# EAGLE design CAPT-B1-02 Cap Touch Matrix FeatherWing (EAGLE 9.4.2)
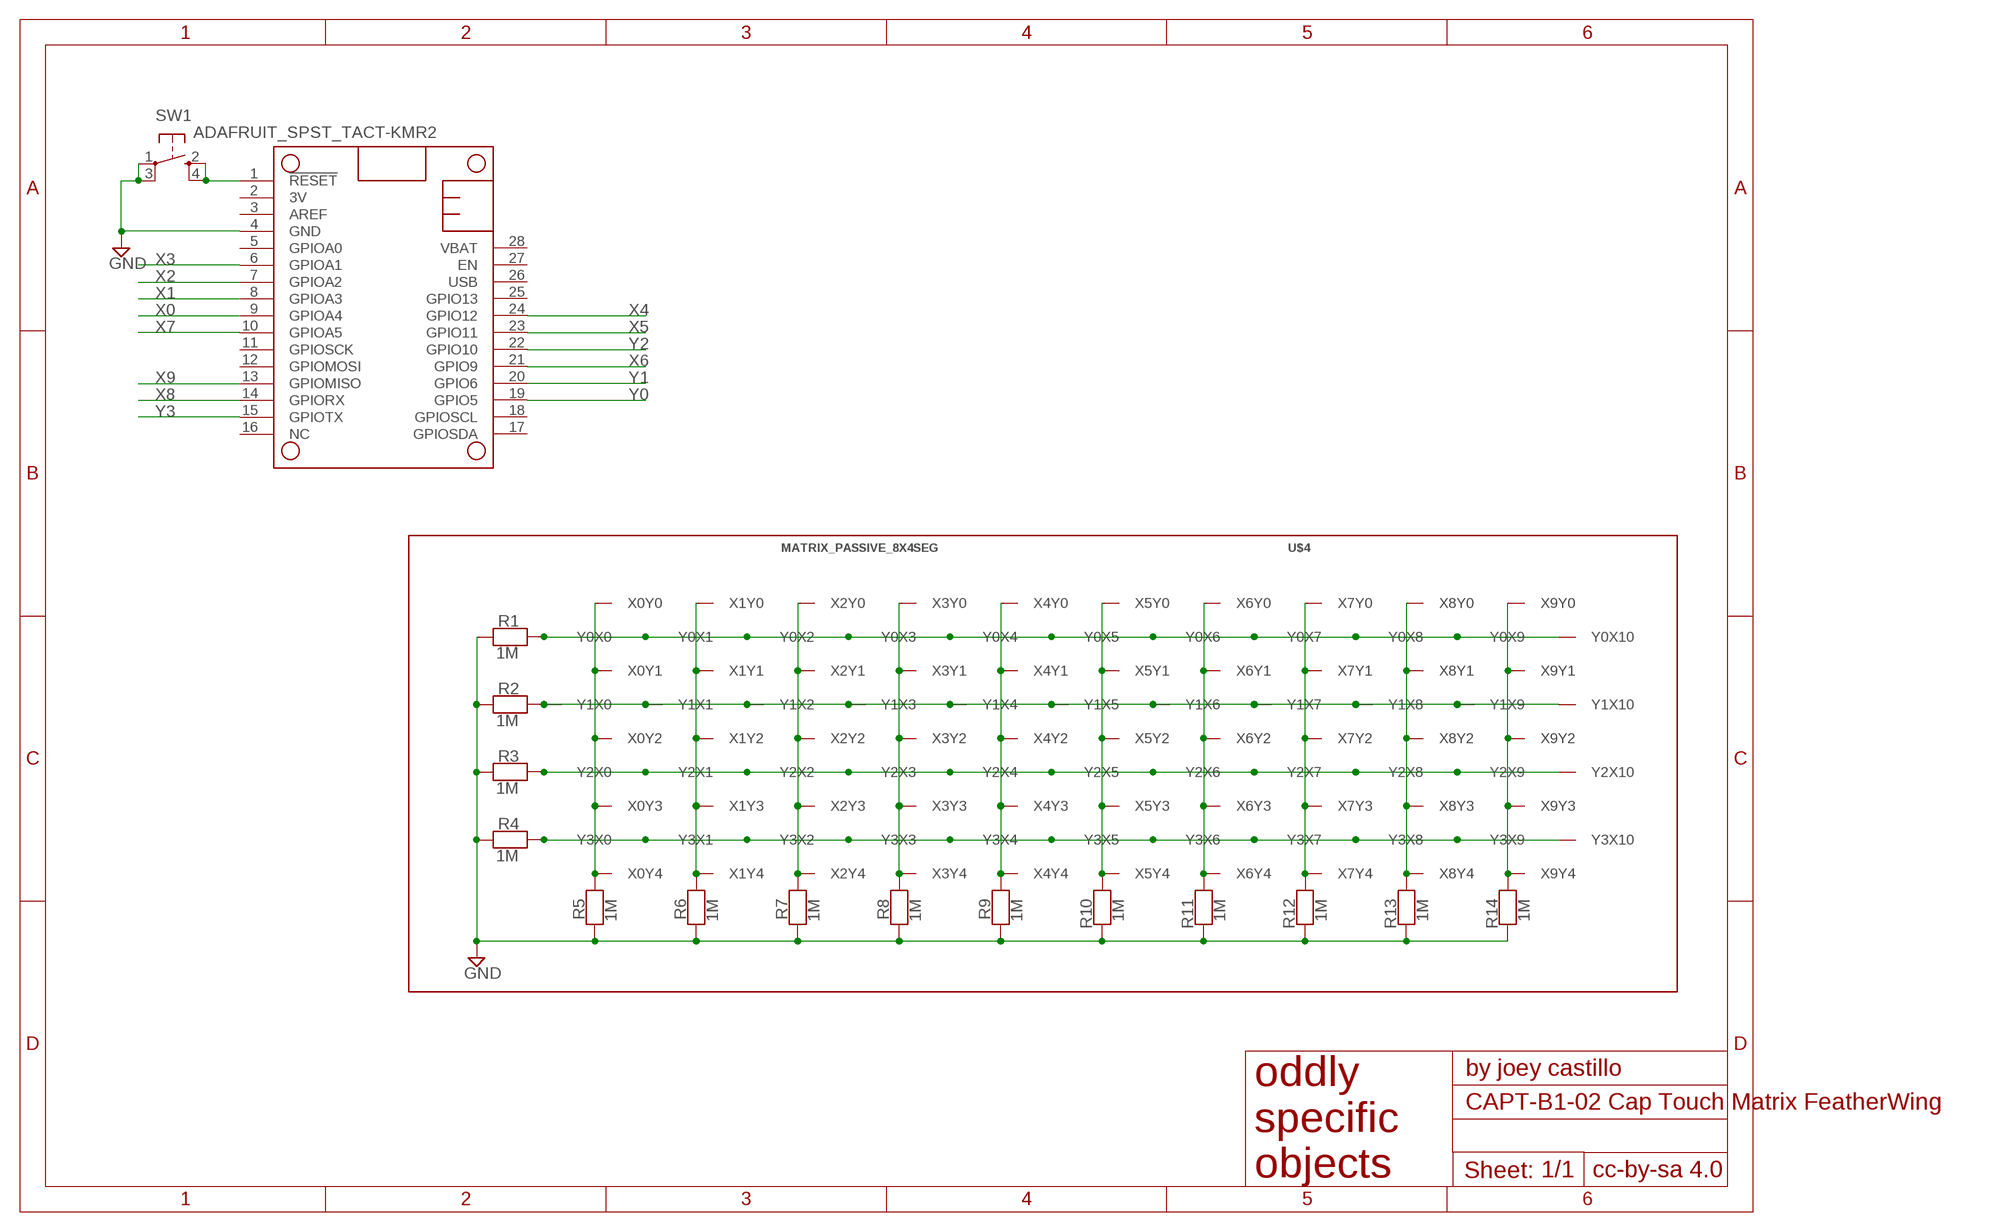
[diagram p0: schematic, sheet 1]

## Parts
MS2  MICROBUILDER_FEATHERWING_NOHOLES  [MICROBUILDER_FEATHERWING_NOHOLES]
R1  1M  RESISTOR0805_10MGAP  [0805_10MGAP]
R2  1M  RESISTOR0805_10MGAP  [0805_10MGAP]
R3  1M  RESISTOR0805_10MGAP  [0805_10MGAP]
R4  1M  RESISTOR0805_10MGAP  [0805_10MGAP]
R5  1M  RESISTOR0805_10MGAP  [0805_10MGAP]
R6  1M  RESISTOR0805_10MGAP  [0805_10MGAP]
R7  1M  RESISTOR0805_10MGAP  [0805_10MGAP]
R8  1M  RESISTOR0805_10MGAP  [0805_10MGAP]
R9  1M  RESISTOR0805_10MGAP  [0805_10MGAP]
R10  1M  RESISTOR0805_10MGAP  [0805_10MGAP]
R11  1M  RESISTOR0805_10MGAP  [0805_10MGAP]
R12  1M  RESISTOR0805_10MGAP  [0805_10MGAP]
R13  1M  RESISTOR0805_10MGAP  [0805_10MGAP]
R14  1M  RESISTOR0805_10MGAP  [0805_10MGAP]
SW1  ADAFRUIT_SPST_TACT-KMR2  [ADAFRUIT_KMR2]
U$4  MATRIX_PASSIVE_8X4SEG  [MATRIX_ACTIVE_8X4SEG_4MM]

## Nets
!RESET: MS2.1(!RESET) SW1.2(S) SW1.4(S1)
GND: MS2.4(GND) R1.2 R2.2 R3.2 R4.2 R5.2 R6.2 R7.2 R8.2 R9.2 R10.2 R11.2 R12.2 R13.2 R14.2 SW1.1(P) SW1.3(P1)
X0: MS2.9(GPIOA4) R5.1 U$4.X0Y0 U$4.X0Y1 U$4.X0Y2 U$4.X0Y3 U$4.X0Y4
X1: MS2.8(GPIOA3) R6.1 U$4.X1Y0 U$4.X1Y1 U$4.X1Y2 U$4.X1Y3 U$4.X1Y4
X2: MS2.7(GPIOA2) R7.1 U$4.X2Y0 U$4.X2Y1 U$4.X2Y2 U$4.X2Y3 U$4.X2Y4
X3: MS2.6(GPIOA1) R8.1 U$4.X3Y0 U$4.X3Y1 U$4.X3Y2 U$4.X3Y3 U$4.X3Y4
X4: MS2.24(GPIO12) R9.1 U$4.X4Y0 U$4.X4Y1 U$4.X4Y2 U$4.X4Y3 U$4.X4Y4
X5: MS2.23(GPIO11) R10.1 U$4.X5Y0 U$4.X5Y1 U$4.X5Y2 U$4.X5Y3 U$4.X5Y4
X6: MS2.21(GPIO9) R11.1 U$4.X6Y0 U$4.X6Y1 U$4.X6Y2 U$4.X6Y3 U$4.X6Y4
X7: MS2.10(GPIOA5) R12.1 U$4.X7Y0 U$4.X7Y1 U$4.X7Y2 U$4.X7Y3 U$4.X7Y4
X8: MS2.14(GPIORX) R13.1 U$4.X8Y0 U$4.X8Y1 U$4.X8Y2 U$4.X8Y3 U$4.X8Y4
X9: MS2.13(GPIOMISO) R14.1 U$4.X9Y0 U$4.X9Y1 U$4.X9Y2 U$4.X9Y3 U$4.X9Y4
Y0: MS2.19(GPIO5) R1.1 U$4.Y0X0 U$4.Y0X1 U$4.Y0X2 U$4.Y0X3 U$4.Y0X4 U$4.Y0X5 U$4.Y0X6 U$4.Y0X7 U$4.Y0X8 U$4.Y0X9 U$4.Y0X10
Y1: MS2.20(GPIO6) R2.1 U$4.Y1X0 U$4.Y1X1 U$4.Y1X2 U$4.Y1X3 U$4.Y1X4 U$4.Y1X5 U$4.Y1X6 U$4.Y1X7 U$4.Y1X8 U$4.Y1X9 U$4.Y1X10
Y2: MS2.22(GPIO10) R3.1 U$4.Y2X0 U$4.Y2X1 U$4.Y2X2 U$4.Y2X3 U$4.Y2X4 U$4.Y2X5 U$4.Y2X6 U$4.Y2X7 U$4.Y2X8 U$4.Y2X9 U$4.Y2X10
Y3: MS2.15(GPIOTX) R4.1 U$4.Y3X0 U$4.Y3X1 U$4.Y3X2 U$4.Y3X3 U$4.Y3X4 U$4.Y3X5 U$4.Y3X6 U$4.Y3X7 U$4.Y3X8 U$4.Y3X9 U$4.Y3X10
Unconnected: MS2.2(3V) MS2.3(AREF) MS2.5(GPIOA0) MS2.11(GPIOSCK) MS2.12(GPIOMOSI) MS2.16(NC) MS2.17(GPIOSDA) MS2.18(GPIOSCL) MS2.25(GPIO13) MS2.26(USB) MS2.27(EN) MS2.28(VBAT)

## Library data of the parts
MS2 = Adafruit 3.5in 480x320 FeatherWing:MICROBUILDER_FEATHERWING
R1-R14 = microbuilder:RESISTOR: Resistors For new designs, use the packages preceded by an '_' character since they are more reliable: The following footprints should be used on most boards: _0402 - Standard footprint for regular board layouts _0603 - Standard footprint for regular board layouts _0805 - Standard footprint for regular board layouts _1206 - Standard footprint for regular board layouts For extremely tight-pitch boards where space is at a premium, the following 'micro-pitch' footprints can be used (smaller pads, no silkscreen outline, etc.): _0402MP - Micro-pitch footprint for very dense/compact boards _0603MP - Micro-pitch footprint for very dense/compact boards _0805MP - Micro-pitch footprint for very dense/compact boards _1206MP - Micro-pitch footprint for very dense/compact boards
SW1 = Adafruit Feather M0 Express:ADAFRUIT_SPST_TACT: SMT 6mm switch, EVQQ2 series http://www.ladyada.net/library/eagle
U$4 = My Stuff:MATRIX_PASSIVE_8X4SEG

## Board
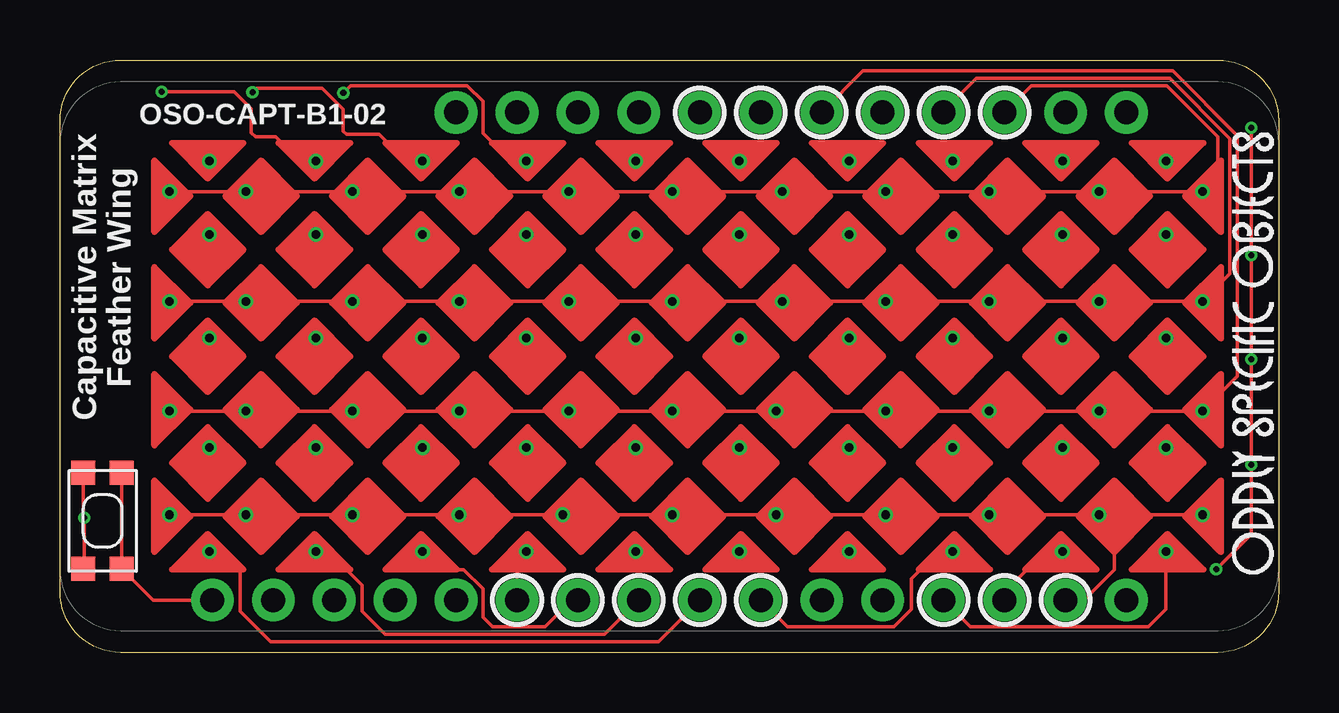
[diagram p1: board, top side]
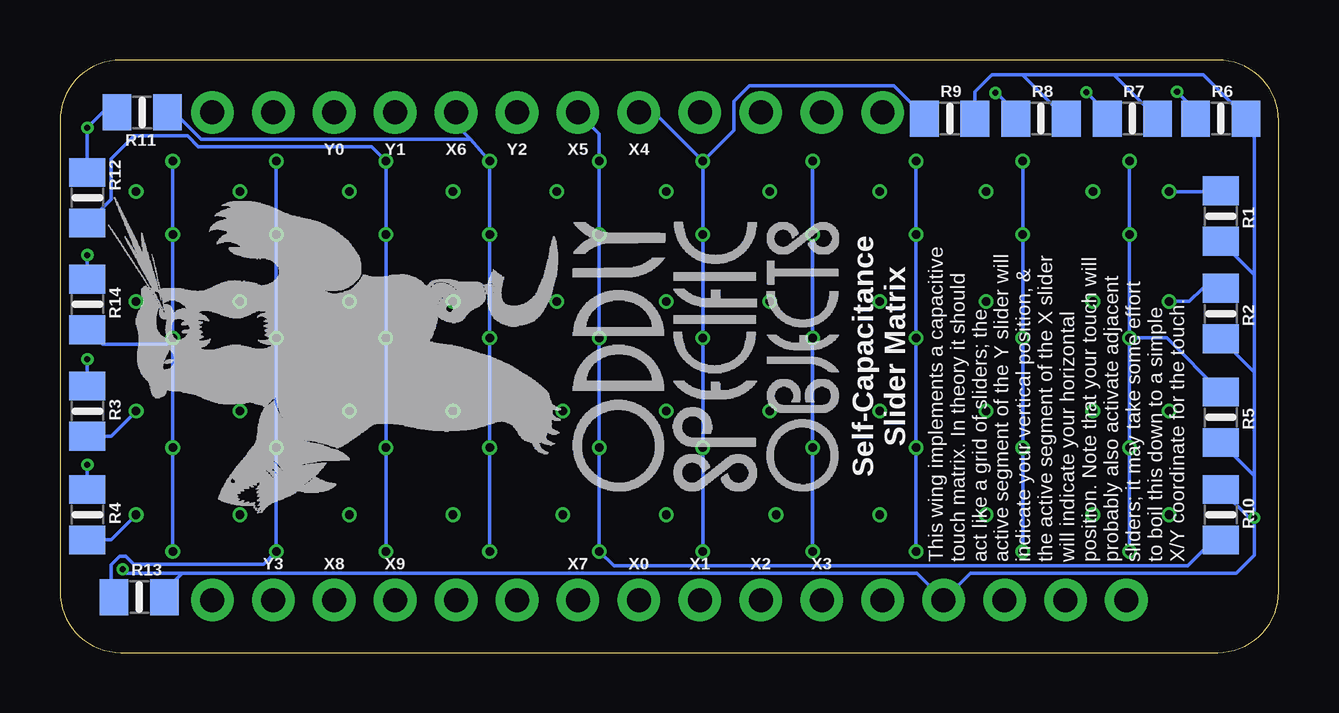
[diagram p2: board, bottom side, seen from below]

Size 50.8 x 24.69 mm. Coordinates in mm from the lower left corner, seen from the top.
Outline: 48.26,0 2.54,0 arc-90 0,2.54 0,22.15 arc-90 2.54,24.69 48.26,24.69 arc-90 50.8,22.15 50.8,2.54 arc-90 48.26,0
Copper layers (1*16): Top 0.035559375mm / dielectric 1.6mm / Bottom 0.035559375mm
Design rules "oshpark-2layer *": minimum track width 6mil, minimum drill 10mil, track to track 6mil, track to pad 6mil, pad to pad 6mil, via to via 6mil, smd to smd 6mil, copper to edge 15mil, drill to drill 6mil, minimum pad ring 5mil, minimum via ring 5mil, stop-mask expansion 2.5mil, vias tented up to drill 10mil, thermal gap 10mil

### Footprints (pad centres in the part's own frame; a part is rotated, then mirrored left to right if it is on the bottom)
MICROBUILDER_FEATHERWING_NOHOLES = drill 1 pad 1.778: 1 6.35,1.27; 2 8.89,1.27; 3 11.43,1.27; 4 13.97,1.27; 5 16.51,1.27; 6 19.05,1.27; 7 21.59,1.27; 8 24.13,1.27; 9 26.67,1.27; 10 29.21,1.27; 11 31.75,1.27; 12 34.29,1.27; 13 36.83,1.27; 14 39.37,1.27; 15 41.91,1.27; 16 44.45,1.27; 17 44.45,21.59; 18 41.91,21.59; 19 39.37,21.59; 20 36.83,21.59; 21 34.29,21.59; 22 31.75,21.59; 23 29.21,21.59; 24 26.67,21.59; 25 24.13,21.59; 26 21.59,21.59; 27 19.05,21.59; 28 16.51,21.59
0805_10MGAP = smd 1.2 x 1.5: 1 -1.05,0; 2 1.05,0
ADAFRUIT_KMR2 = smd 1 x 1: 1 2,0.8; 2 2,-0.8; 3 -2,0.8; 4 -2,-0.8
MATRIX_ACTIVE_8X4SEG_4MM = drill 0.356: X0Y0 -19.939,8.128; X0Y1 -19.939,5.08; X0Y2 -19.939,0.762; X0Y3 -19.939,-3.81; X0Y4 -19.939,-8.128; X1Y0 -15.494,8.128; X1Y1 -15.494,5.08; X1Y2 -15.494,0.762; X1Y3 -15.494,-3.81; X1Y4 -15.494,-8.128; X2Y0 -11.049,8.128; X2Y1 -11.049,5.08; X2Y2 -11.049,0.762; X2Y3 -11.049,-3.81; X2Y4 -11.049,-8.128; X3Y0 -6.731,8.128; X3Y1 -6.731,5.08; X3Y2 -6.731,0.762; X3Y3 -6.731,-3.81; X3Y4 -6.731,-8.128; X4Y0 -2.159,8.128; X4Y1 -2.159,5.08; X4Y2 -2.159,0.762; X4Y3 -2.159,-3.81; X4Y4 -2.159,-8.128; X5Y0 2.159,8.128; X5Y1 2.159,5.08; X5Y2 2.159,0.762; X5Y3 2.159,-3.81; X5Y4 2.159,-8.128; X6Y0 6.731,8.128; X6Y1 6.731,5.08; X6Y2 6.731,0.762; X6Y3 6.731,-3.81; X6Y4 6.731,-8.128; X7Y0 11.049,8.128; X7Y1 11.049,5.08; X7Y2 11.049,0.762; X7Y3 11.049,-3.81; X7Y4 11.049,-8.128; X8Y0 15.621,8.128; X8Y1 15.621,5.08; X8Y2 15.621,0.762; X8Y3 15.621,-3.81; X8Y4 15.621,-8.128; X9Y0 19.939,8.128; X9Y1 19.939,5.08; X9Y2 19.939,0.762; X9Y3 19.939,-3.81; X9Y4 19.939,-8.128; Y0X0 -21.59,6.858; Y0X1 -18.415,6.858; Y0X2 -13.97,6.858; Y0X3 -9.525,6.858; Y0X4 -4.953,6.858; Y0X5 -0.635,6.858; Y0X6 3.937,6.858; Y0X7 8.255,6.858; Y0X8 12.573,6.858; Y0X9 17.145,6.858; Y0X10 21.463,6.858; Y1X0 -21.59,2.286; Y1X1 -18.415,2.286; Y1X2 -13.97,2.286; Y1X3 -9.525,2.286; Y1X4 -4.953,2.286; Y1X5 -0.635,2.286; Y1X6 3.937,2.286; Y1X7 8.255,2.286; Y1X8 12.573,2.286; Y1X9 17.145,2.286; Y1X10 21.463,2.286; Y2X0 -21.59,-2.286; Y2X1 -18.415,-2.286; Y2X2 -13.97,-2.286; Y2X3 -9.525,-2.286; Y2X4 -4.953,-2.286; Y2X5 -0.635,-2.286; Y2X6 3.683,-2.286; Y2X7 8.255,-2.286; Y2X8 12.573,-2.286; Y2X9 17.145,-2.286; Y2X10 21.463,-2.286; Y3X0 -21.59,-6.604; Y3X1 -18.415,-6.604; Y3X2 -13.97,-6.604; Y3X3 -9.525,-6.604; Y3X4 -5.207,-6.604; Y3X5 -0.635,-6.604; Y3X6 3.683,-6.604; Y3X7 8.255,-6.604; Y3X8 12.573,-6.604; Y3X9 17.145,-6.604; Y3X10 21.463,-6.604

### Placement (x,y rotation side)
MS2  0,0.91 0 top
R1  2.41,18.19 270 bottom
R2  2.41,14.12 270 bottom
R3  49.66,10.06 90 bottom
R4  49.66,5.74 90 bottom
R5  2.41,9.8 270 bottom
R6  2.41,22.25 0 bottom
R7  6.1,22.25 0 bottom
R8  9.91,22.25 0 bottom
R9  13.72,22.25 0 bottom
R10  2.41,5.74 90 bottom
R11  47.37,22.5 180 bottom
R12  49.66,18.95 90 bottom
R13  47.5,2.31 0 bottom
R14  49.66,14.5 90 bottom
SW1  1.78,5.49 90 top
U$1  [OSO_WORDMARK_THREELINE_450MIL_1000DPI]  23.88,12.34 90 bottom
U$2  [OSO_BEAR_525X750MIL_1000DPI]  39.37,12.34 90 bottom
U$3  [OSO_WORDMARK_ONELINE_725MIL_1000DPI]  50.67,3.2 90 top
U$4  26.16,12.34 0 top

### Tracks (layer width: path | path; a pad name or v marks a point on that pad's centre or on a via)
!RESET
  Top 0.152: MS2.1 3.88,2.18 SW1.4 SW1.2
GND  (via drill 0.25)
  Top 0.152: SW1.1 0.98,5.65 v1.02,5.61 1.02,3.52 SW1.3 | v48.19,3.47 49.66,4.93 v49.66,7.82 v49.66,12.22 v49.66,16.56 v49.66,21.87
  Bottom 0.152: R9.2 12.67,23.37 11.96,24.08 10.69,24.08 | 10.69,24.08 6.88,24.08 | 6.88,24.08 3.15,24.08 1.36,22.3 R6.2 1.02,21.9 1.02,15.74 | R10.2 1.24,5.61 v1.02,5.61 | v1.02,5.61 1.02,4.06 1.77,3.3 12.85,3.3 MS2.4 15.09,3.3 45.71,3.3 | R5.2 1.02,7.36 | 1.02,7.36 v1.02,5.61 | R2.2 1.02,11.68 | 1.02,11.68 1.02,7.36 | R1.2 1.02,15.74 | 1.02,15.74 1.02,11.68 | R7.2 6.88,24.08 | R8.2 10.69,24.08 | R11.2 49.02,22.5 v49.66,21.87 R12.2 | R14.2 v49.66,16.56 | R3.2 v49.66,12.22 | R4.2 v49.66,7.82 | R13.2 46.45,2.57 45.71,3.3 | v48.19,3.47 48.02,3.3 45.71,3.3
X0
  Top 0.152: U$4.X0Y4 6.66,4.22 7.52,3.35 7.52,1.72 8.78,0.46 24.94,0.46 MS2.9
  Bottom 0.152: U$4.X0Y2 U$4.X0Y1 U$4.X0Y0 | U$4.X0Y4 U$4.X0Y3 U$4.X0Y2 | U$4.X0Y2 4.67,13.11 R5.1
X1  (via drill 0.25)
  Top 0.152: U$4.X1Y4 11.18,4.22 12.6,2.8 12.6,1.72 13.56,0.76 22.71,0.76 MS2.8 | U$4.X1Y0 10.01,20.47 8.99,21.49 8.15,21.49 7.98,21.67 7.98,22.66 7.26,23.37 v4.24,23.37
  Bottom 0.152: U$4.X1Y4 U$4.X1Y3 U$4.X1Y2 U$4.X1Y1 U$4.X1Y0 | 3.46,22.16 R6.1 3.46,22.59 v4.24,23.37
X2  (via drill 0.25)
  Top 0.152: U$4.X2Y4 15.88,3.45 16.82,3.45 17.63,2.65 17.63,1.47 18.03,1.07 20.22,1.07 21.34,2.18 MS2.7 | U$4.X2Y0 14.43,20.47 13.31,21.59 11.94,21.59 11.81,21.72 11.81,22.63 10.92,23.52 8.2,23.52 v8.02,23.34
  Bottom 0.152: U$4.X2Y4 U$4.X2Y3 U$4.X2Y2 U$4.X2Y1 U$4.X2Y0 | v8.02,23.34 7.15,22.47 R7.1
X3  (via drill 0.25)
  Top 0.152: U$4.X3Y4 19.05,3.84 MS2.6 | v11.81,23.32 12.12,23.62 16.97,23.62 17.63,22.97 17.63,21.64 18.8,20.47 U$4.X3Y0
  Bottom 0.152: U$4.X3Y4 U$4.X3Y3 U$4.X3Y2 U$4.X3Y1 U$4.X3Y0 | 10.96,22.03 R8.1 10.96,22.5 11.77,23.32 v11.81,23.32
X4
  Bottom 0.152: U$4.X4Y4 U$4.X4Y3 U$4.X4Y2 U$4.X4Y1 U$4.X4Y0 | 15.01,22.3 R9.1 14.77,22.34 16.05,23.62 22.05,23.62 22.71,22.97 22.71,21.77 U$4.X4Y0 | MS2.24 26.57,22.4 25.93,22.4 U$4.X4Y0
X5
  Bottom 0.152: R10.1 2.71,4.69 3.79,3.61 27.71,3.61 U$4.X5Y4 U$4.X5Y3 U$4.X5Y2 U$4.X5Y1 U$4.X5Y0 28.32,21.62 MS2.23
X6
  Bottom 0.152: U$4.X6Y4 U$4.X6Y3 U$4.X6Y2 U$4.X6Y1 U$4.X6Y0 33.68,21.39 | R11.1 46.03,22.5 44.91,21.39 33.68,21.39 | MS2.21 34.29,22 33.68,21.39
X7
  Top 0.152: U$4.X7Y4 36.63,4.22 35.48,3.07 35.48,1.8 34.75,1.07 30.33,1.07 MS2.10
  Bottom 0.152: U$4.X7Y4 U$4.X7Y3 U$4.X7Y2 U$4.X7Y1 U$4.X7Y0 37.82,21.08 45.04,21.08 45.48,21.53 47.72,21.53 48.67,20.57 48.67,18.89 R12.1
X8
  Top 0.152: MS2.14 39.37,2.51 41.07,4.22 U$4.X8Y4
  Bottom 0.152: R13.1 48.67,2.44 48.67,3.67 48.32,4.02 48.06,4.02 47.72,3.68 42.32,3.68 U$4.X8Y4 U$4.X8Y3 U$4.X8Y2 U$4.X8Y1 U$4.X8Y0
X9
  Top 0.152: U$4.X9Y4 46.1,1.8 45.36,1.07 37.95,1.07 MS2.13
  Bottom 0.152: U$4.X9Y4 U$4.X9Y3 U$4.X9Y2 | U$4.X9Y2 U$4.X9Y1 U$4.X9Y0 | R14.1 49.62,13.45 49.02,12.85 46.35,12.85 U$4.X9Y2
Y0
  Top 0.152: U$4.Y0X0 U$4.Y0X1 U$4.Y0X2 U$4.Y0X3 U$4.Y0X4 U$4.Y0X5 U$4.Y0X6 U$4.Y0X7 U$4.Y0X8 U$4.Y0X9 U$4.Y0X10 48.26,19.84 48.26,21.49 46.13,23.62 40.49,23.62 MS2.19
  Bottom 0.152: U$4.Y0X0 2.45,19.2 R1.1
Y1
  Top 0.152: U$4.Y1X0 U$4.Y1X1 U$4.Y1X2 U$4.Y1X3 U$4.Y1X4 U$4.Y1X5 U$4.Y1X6 U$4.Y1X7 U$4.Y1X8 U$4.Y1X9 U$4.Y1X10 48.77,15.77 48.77,21.41 46.25,23.93 38.2,23.93 36.83,22.56 MS2.20
  Bottom 0.152: U$4.Y1X0 3.72,14.63 3.17,15.17 R2.1
Y2
  Top 0.152: U$4.Y2X0 U$4.Y2X1 U$4.Y2X2 U$4.Y2X3 U$4.Y2X4 U$4.Y2X5 U$4.Y2X6 U$4.Y2X7 U$4.Y2X8 U$4.Y2X9 U$4.Y2X10 49.07,11.51 49.07,21.54 46.38,24.23 33.48,24.23 MS2.22
  Bottom 0.152: R3.1 48.67,9.01 U$4.Y2X10
Y3
  Top 0.152: U$4.Y3X0 U$4.Y3X1 U$4.Y3X2 U$4.Y3X3 U$4.Y3X4 U$4.Y3X5 U$4.Y3X6 U$4.Y3X7 U$4.Y3X8 U$4.Y3X9 | U$4.Y3X9 U$4.Y3X10 | U$4.Y3X9 43.94,5.11 43.94,3.45 42.67,2.18 MS2.15
  Bottom 0.152: R4.1 48.67,4.69 U$4.Y3X10

### Text on the board
tPlace: OSO-CAPT-B1-02 | Capacitive Matrix / Feather Wing
bPlace: X4 | X5 | Y2 | X6 | Y1 | Y0 | Self-Capacitance / Slider Matrix | This wing implements a capacitive / touch matrix. In theory it should / act like a grid of sliders; the / active segment of the Y slider will / indicate your vertical position, & / the active segment of the X slider / will indicate your horizontal / position. Note that your touch will / probably also activate adjacent / sliders; it may take some effort / to boil this down to a simple / X/Y coordinate for the touch. | X3 | X2 | X1 | X0 | X7 | X9 | X8 | Y3